# EAGLE schematic boosterpack_0v1_EAGLE_sch (EAGLE 7.2.0)
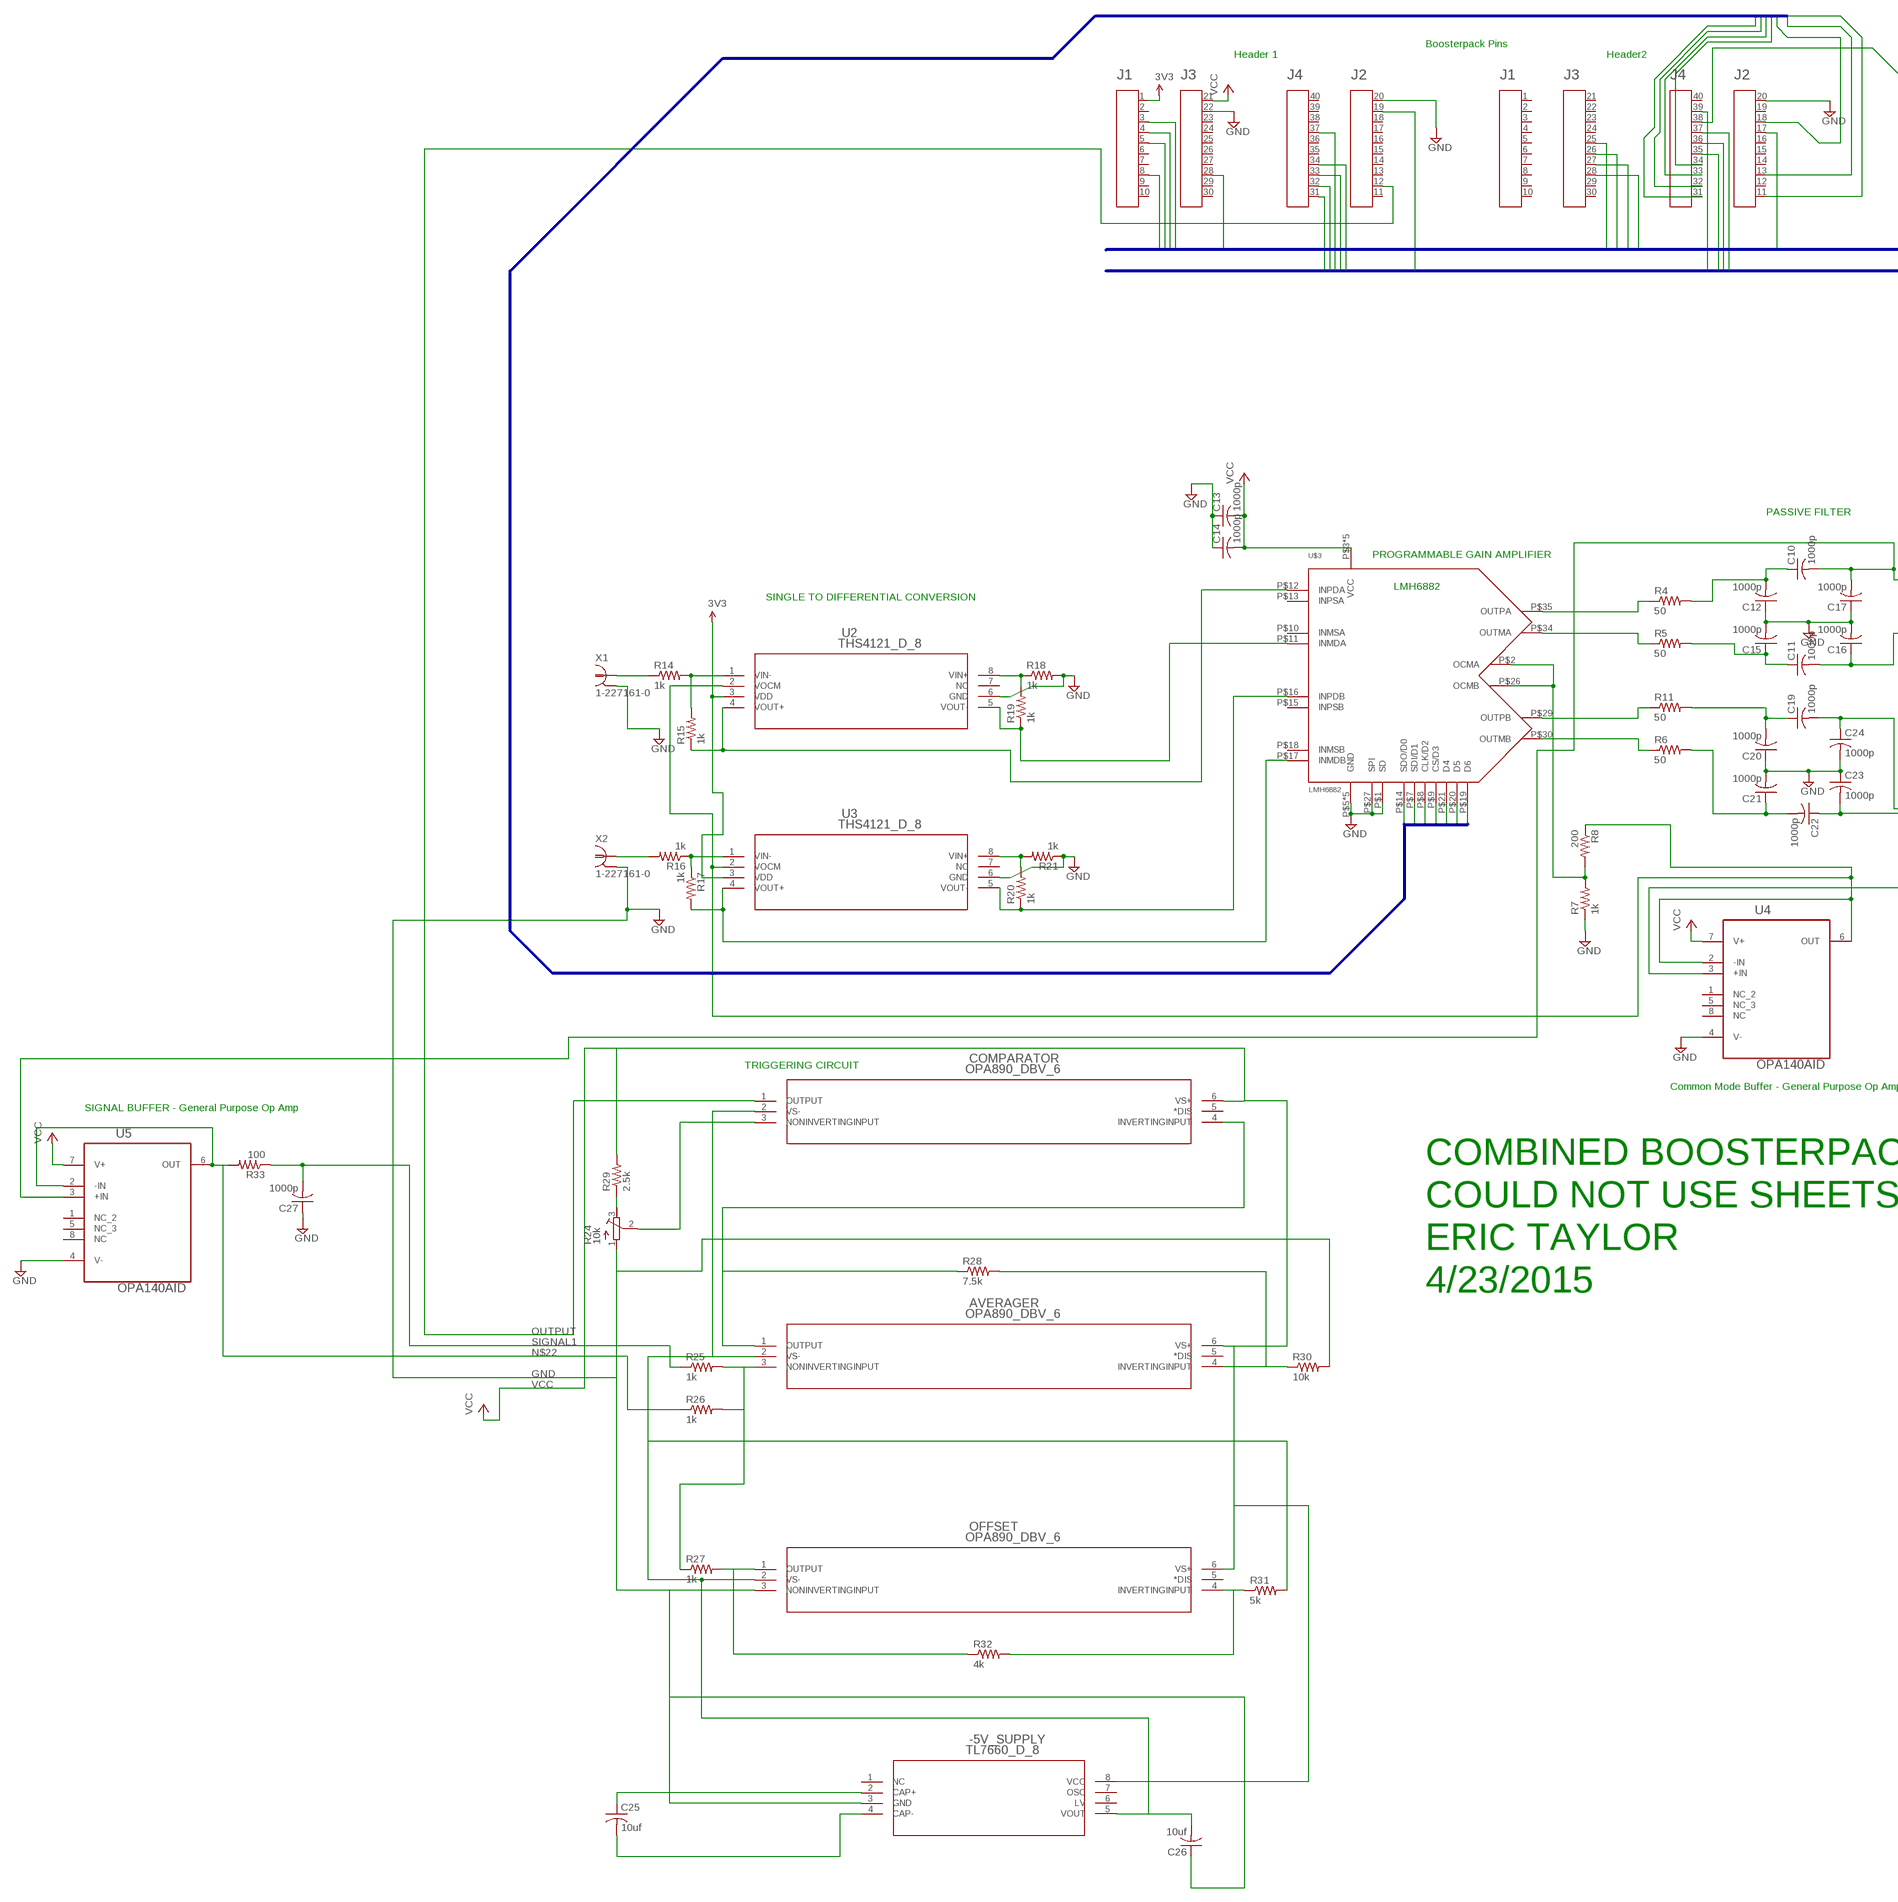
[diagram p0: schematic, sheet 1, part 1 of 2]
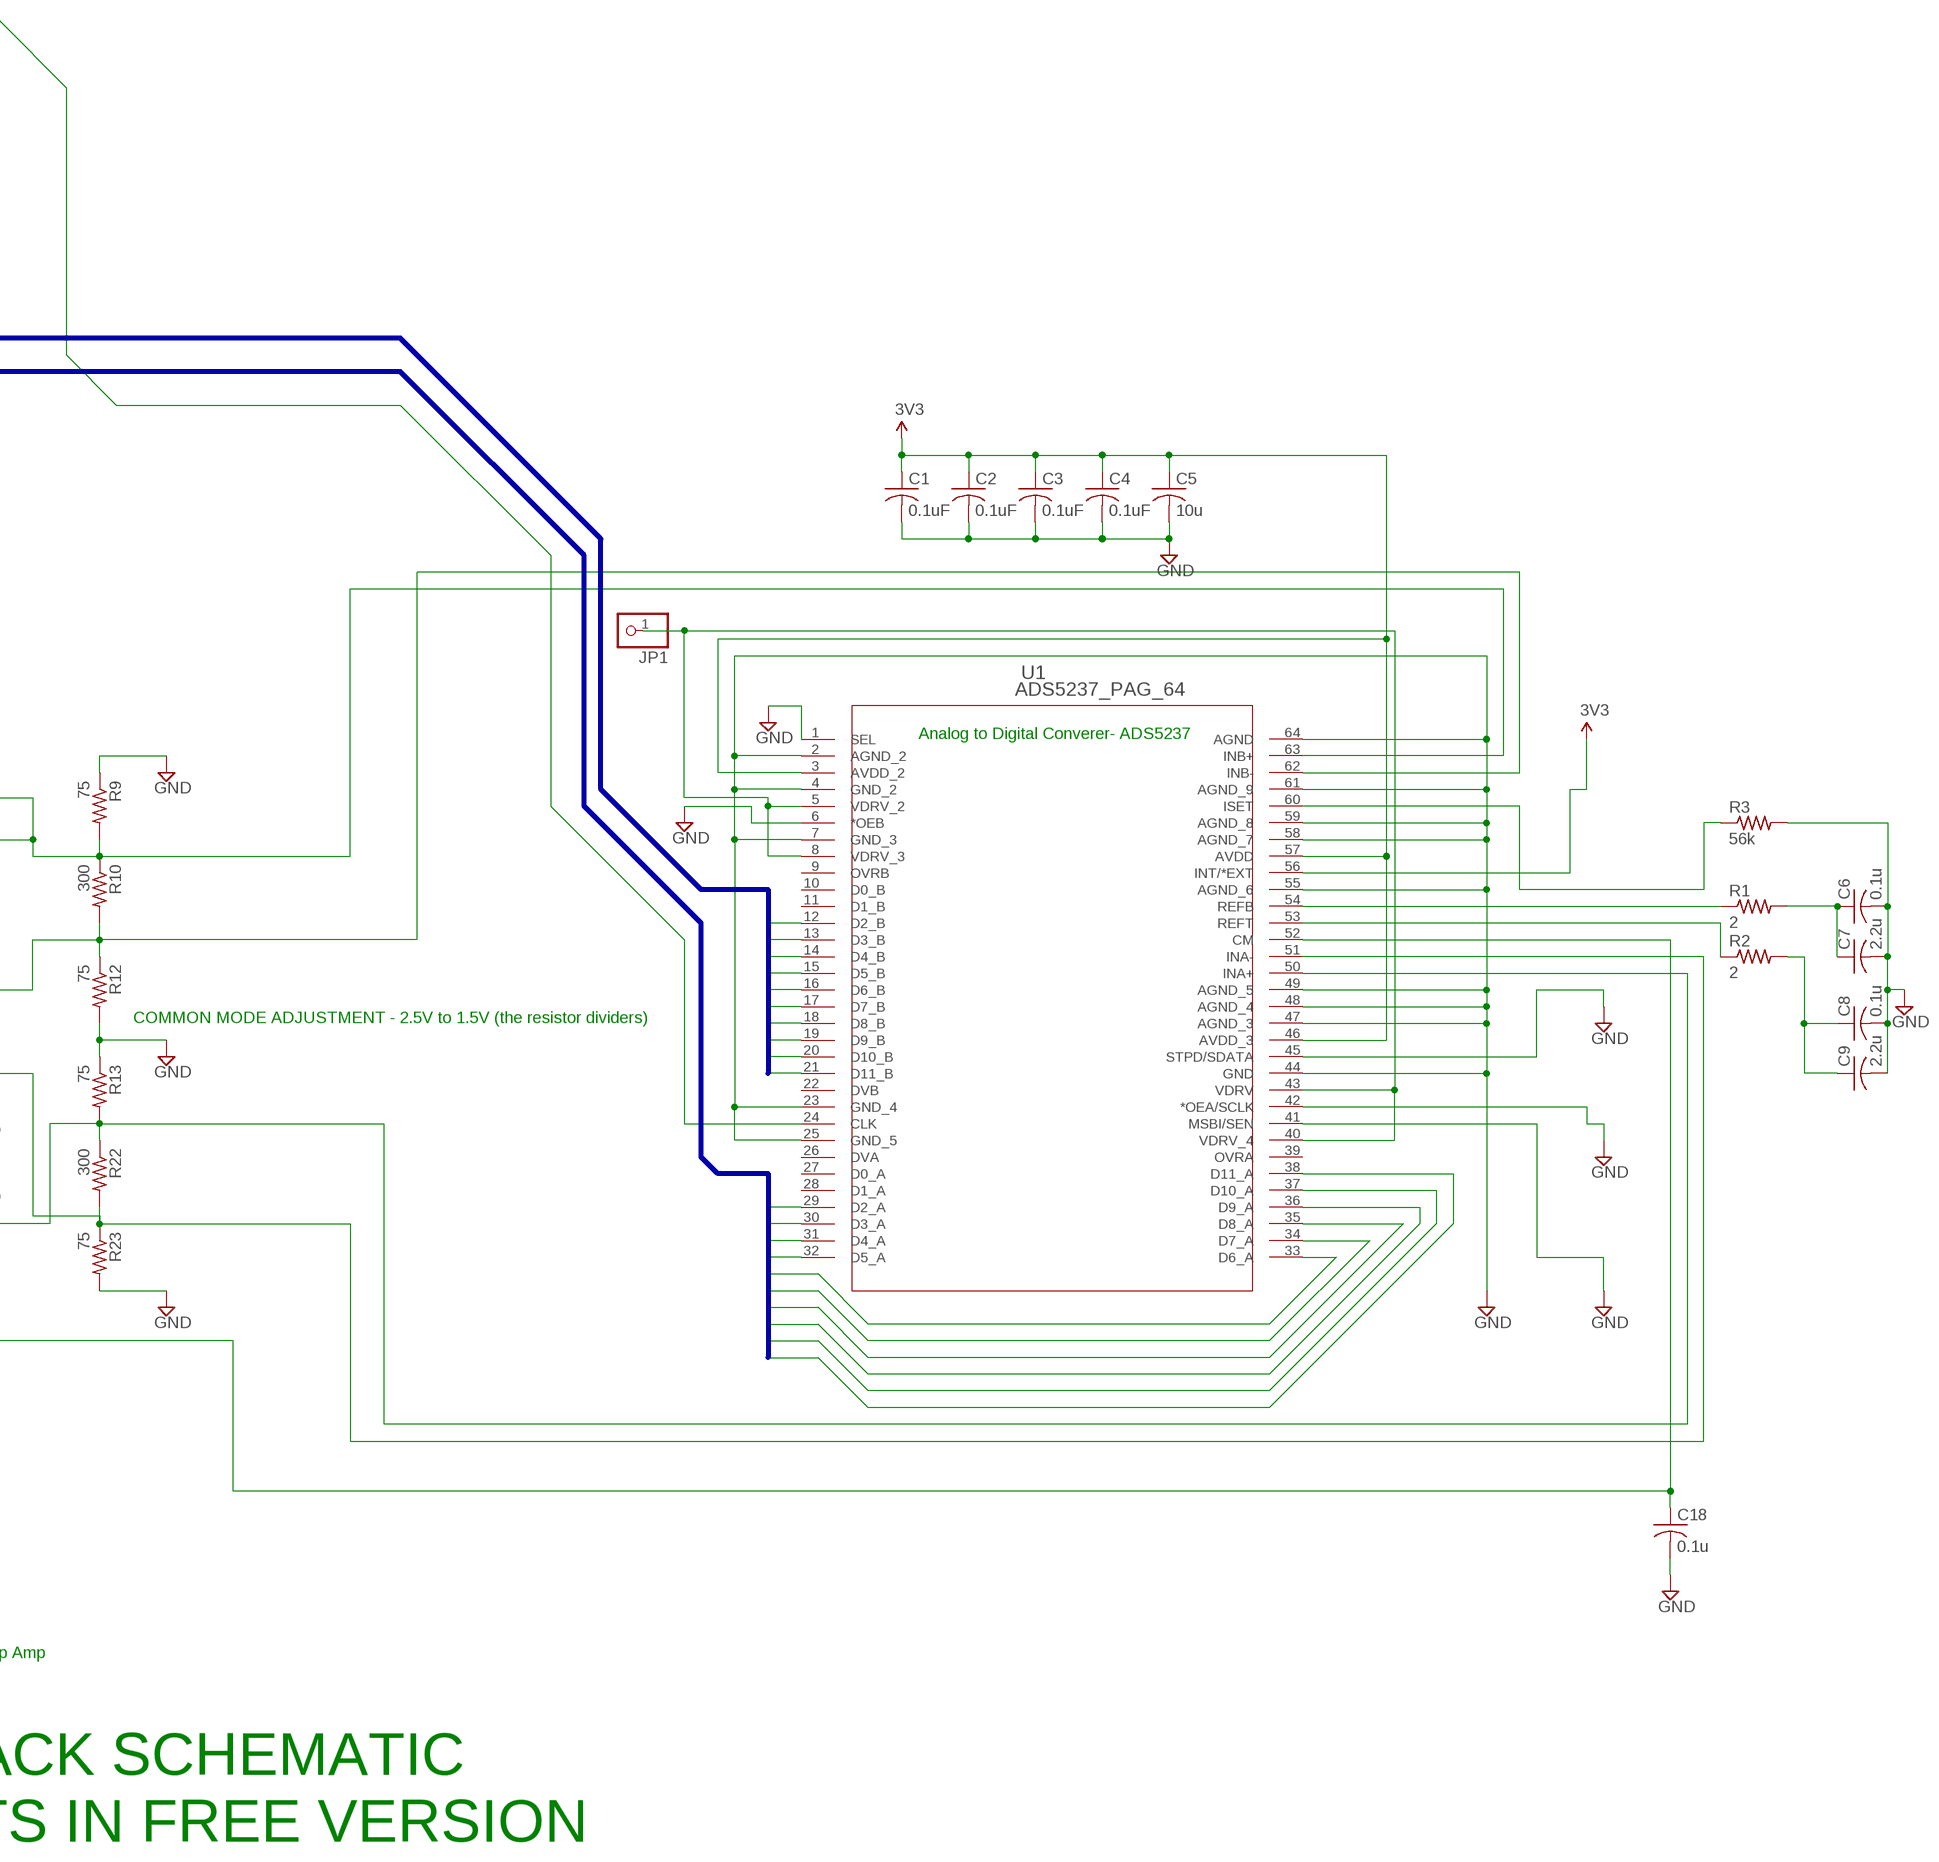
[diagram p1: schematic, sheet 1, part 2 of 2]

## Parts
-5V_SUPPLY  TL7660_D_8  [D8]
A1  HEADER4X10-BOOSTERPACK  [4X10-BOOSTERPACK]
A2  HEADER4X10-BOOSTERPACK  [4X10-BOOSTERPACK]
AVERAGER  OPA890_DBV_6  [DBV6]
C1  0.1uF  C-USC0603  [C0603]
C2  0.1uF  C-USC0603  [C0603]
C3  0.1uF  C-USC0603  [C0603]
C4  0.1uF  C-USC0603  [C0603]
C5  10u  C-USC0805  [C0805]
C6  0.1u  C-USC0805  [C0805]
C7  2.2u  C-USC0805  [C0805]
C8  0.1u  C-USC0805  [C0805]
C9  2.2u  C-USC0805  [C0805]
C10  1000p  C-USC0805  [C0805]
C11  1000p  C-USC0805  [C0805]
C12  1000p  C-USC0805  [C0805]
C13  1000p  C-USC0805  [C0805]
C14  1000p  C-USC0805  [C0805]
C15  1000p  C-USC0805  [C0805]
C16  1000p  C-USC0805  [C0805]
C17  1000p  C-USC0805  [C0805]
C18  0.1u  C-USC0805  [C0805]
C19  1000p  C-USC0805  [C0805]
C20  1000p  C-USC0805  [C0805]
C21  1000p  C-USC0805  [C0805]
C22  1000p  C-USC0805  [C0805]
C23  1000p  C-USC0805  [C0805]
C24  1000p  C-USC0805  [C0805]
C25  10uf  C-USC0805  [C0805]
C26  10uf  C-USC0805  [C0805]
C27  1000p  C-USC0805  [C0805]
COMPARATOR  OPA890_DBV_6  [DBV6]
JP1  PINHD-1X1  [1X01]
OFFSET  OPA890_DBV_6  [DBV6]
R1  2  R-US_R0805  [R0805]
R2  2  R-US_R0805  [R0805]
R3  56k  R-US_R0805  [R0805]
R4  50  R-US_R0805  [R0805]
R5  50  R-US_R0805  [R0805]
R6  50  R-US_R0805  [R0805]
R7  1k  R-US_R0805  [R0805]
R8  200  R-US_R0805  [R0805]
R9  75  R-US_R0805  [R0805]
R10  300  R-US_R0805  [R0805]
R11  50  R-US_R0805  [R0805]
R12  75  R-US_R0805  [R0805]
R13  75  R-US_R0805  [R0805]
R14  1k  R-US_R0805  [R0805]
R15  1k  R-US_R0805  [R0805]
R16  1k  R-US_R0805  [R0805]
R17  1k  R-US_R0805  [R0805]
R18  1k  R-US_R0805  [R0805]
R19  1k  R-US_R0805  [R0805]
R20  1k  R-US_R0805  [R0805]
R21  1k  R-US_R0805  [R0805]
R22  300  R-US_R0805  [R0805]
R23  75  R-US_R0805  [R0805]
R24  10k  R-TRIMM64W  [RTRIM64W]
R25  1k  R-US_M0805  [M0805]
R26  1k  R-US_M0805  [M0805]
R27  1k  R-US_M0805  [M0805]
R28  7.5k  R-US_M0805  [M0805]
R29  2.5k  R-US_M0805  [M0805]
R30  10k  R-US_M0805  [M0805]
R31  5k  R-US_M0805  [M0805]
R32  4k  R-US_M0805  [M0805]
R33  100  R-US_R0805  [R0805]
U1  ADS5237_PAG_64  [PAG64]
U2  THS4121_D_8  [D8]
U3  THS4121_D_8  [D8]
U4  OPA140AID  [SOIC127P600X175-8N]
U5  OPA140AID  [SOIC127P600X175-8N]
U$3  LMH6882  [WQFN-36-NJK]
X1  1-227161-0  [AMP_227161]
X2  1-227161-0  [AMP_227161]

## Nets
3.3V: A2.1 C1.1 C2.1 C3.1 C4.1 C5.1 U1.3(AVDD_2) U1.46(AVDD_3) U1.56(INT/*EXT) U1.57(AVDD) U2.3(VDD) U3.3(VDD) ; supply symbol labelled 3V3
A0: A1.25 U1.12(D2_B)
A1: A1.26 U1.13(D3_B)
A2: A1.27 U1.14(D4_B)
A3: A1.28 U1.15(D5_B)
A4: A2.8 U1.16(D6_B)
A5: A2.5 U1.17(D7_B)
A6: A2.4 U1.18(D8_B)
A7: A2.3 U1.19(D9_B)
A8: A2.28 U1.20(D10_B)
A9: A1.17 U1.21(D11_B)
B0: A1.39 U1.29(D2_A)
B1: A2.37 U1.30(D3_A)
B2: A2.19 U1.31(D4_A)
B3: A1.35 U1.32(D5_A)
B4: A1.36 U1.33(D6_A)
B5: A1.37 U1.34(D7_A)
B6: A2.34 U1.35(D8_A)
B7: A2.33 U1.36(D9_A)
B8: A2.32 U1.37(D10_A)
B9: A2.31 U1.38(D11_A)
C0: A1.11 U$3.P$14(SDO/D0)
C1: A1.13 U$3.P$7(SDI/D1)
C2: A1.18 U$3.P$8(CLK/D2)
C3: A1.34 U$3.P$9(CS/D3)
C4: A1.33 U$3.P$21(D4)
C5: A1.32 U$3.P$20(D5)
C6: A1.31 U$3.P$19(D6)
GND: -5V_SUPPLY.3(GND) A1.20 A2.20 A2.22 C1.2 C2.2 C3.2 C4.2 C5.2 C6.2 C7.2 C8.2 C9.2 C12.1 C13.1 C14.1 C15.2 C16.2 C17.1 C18.2 C20.1 C21.2 C23.1 C24.2 C26.1 C27.1 OFFSET.3(NONINVERTINGINPUT) R3.2 R7.1 R9.1 R12.2 R13.1 R18.2 R21.1 R23.2 R24.1(E) R30.2 U1.1(SEL) U1.2(AGND_2) U1.4(GND_2) U1.6(*OEB) U1.7(GND_3) U1.23(GND_4) U1.25(GND_5) U1.41(MSBI/SEN) U1.42(*OEA/SCLK) U1.44(GND) U1.45(STPD/SDATA) U1.47(AGND_3) U1.48(AGND_4) U1.49(AGND_5) U1.55(AGND_6) U1.58(AGND_7) U1.59(AGND_8) U1.61(AGND_9) U1.64(AGND) U2.6(GND) U3.6(GND) U4.4(V-) U5.4(V-) U$3.P$1(SD) U$3.P$5(GND) U$3.P$6(GND) U$3.P$22(GND) U$3.P$23(GND) U$3.P$27(SPI) U$3.TH(GND) X1.2 X2.2
N$1: A1.38 U1.24(CLK)
N$2: JP1.1 U1.5(VDRV_2) U1.8(VDRV_3) U1.40(VDRV_4) U1.43(VDRV)
N$3: C18.1 U1.52(CM) U4.3(+IN)
N$4: C19.2 C24.1 R22.2 R23.1 U1.51(INA-)
N$5: R24.3(A) R29.1
N$6: COMPARATOR.3(NONINVERTINGINPUT) R24.2(S)
N$7: AVERAGER.4(INVERTINGINPUT) R28.2 R30.1
N$8: C11.1 C15.1 R5.2
N$9: R8.1 U2.2(VOCM) U3.2(VOCM) U4.2(-IN) U4.6(OUT)
N$10: R7.2 R8.2 U$3.P$2(OCMA) U$3.P$26(OCMB)
N$11: AVERAGER.3(NONINVERTINGINPUT) R25.2 R26.2 R27.1
N$13: C11.2 C16.1 R10.2 R12.1 U1.62(INB-)
N$14: C21.1 C22.2 R6.2
N$15: C19.1 C20.2 R11.2
N$16: AVERAGER.1(OUTPUT) COMPARATOR.4(INVERTINGINPUT) R28.1
N$17: C22.1 C23.2 R13.2 R22.1 U1.50(INA+)
N$18: OFFSET.1(OUTPUT) R27.2 R32.1
N$20: OFFSET.4(INVERTINGINPUT) R31.1 R32.2
N$21: R5.1 U$3.P$34(OUTMA)
N$22: R26.1 R33.2 U5.2(-IN) U5.6(OUT)
N$23: -5V_SUPPLY.2(CAP+) C25.1
N$24: -5V_SUPPLY.4(CAP-) C25.2
N$25: -5V_SUPPLY.5(VOUT) AVERAGER.2(VS-) C26.2 COMPARATOR.2(VS-) OFFSET.2(VS-) R31.2
N$26: C10.2 C17.2 R9.2 R10.1 U1.63(INB+) U5.3(+IN)
N$27: R4.1 U$3.P$35(OUTPA)
N$29: C6.1 C7.1 R1.2
N$30: C8.1 C9.1 R2.2
N$31: R1.1 U1.54(REFB)
N$32: R2.1 U1.53(REFT)
N$33: R3.1 U1.60(ISET)
N$34: R14.1 X1.1
N$41: R6.1 U$3.P$30(OUTMB)
N$42: R14.2 R15.2 U2.1(VIN-)
N$43: R15.1 U2.4(VOUT+) U$3.P$12(INPDA)
N$44: R16.1 R17.1 U3.1(VIN-)
N$47: R17.2 U3.4(VOUT+) U$3.P$17(INMDB)
N$48: R18.1 R19.2 U2.8(VIN+)
N$49: R20.2 R21.2 U3.8(VIN+)
N$51: R16.2 X2.1
N$59: R20.1 U3.5(VOUT-) U$3.P$16(INPDB)
N$60: R19.1 U2.5(VOUT-) U$3.P$11(INMDA)
N$62: R11.1 U$3.P$29(OUTPB)
N$67: C10.1 C12.2 R4.2
OUTPUT: A2.12 COMPARATOR.1(OUTPUT)
SIGNAL1: C27.2 R25.1 R33.1
VCC: -5V_SUPPLY.8(VCC) A2.21 AVERAGER.6(VS+) C13.2 C14.2 COMPARATOR.6(VS+) OFFSET.6(VS+) R29.2 U4.7(V+) U5.7(V+) U$3.P$3(VCC) U$3.P$4(VCC) U$3.P$24(VCC) U$3.P$25(VCC) U$3.P$36(VCC)
Unconnected: -5V_SUPPLY.1(NC) -5V_SUPPLY.6(LV) -5V_SUPPLY.7(OSC) A1.1 A1.2 A1.3 A1.4 A1.5 A1.6 A1.7 A1.8 A1.9 A1.10 A1.12 A1.14 A1.15 A1.16 A1.19 A1.21 A1.22 A1.23 A1.24 A1.29 A1.30 A1.40 A2.2 A2.6 A2.7 A2.9 A2.10 A2.11 A2.13 A2.14 A2.15 A2.16 A2.17 A2.18 A2.23 A2.24 A2.25 A2.26 A2.27 A2.29 A2.30 A2.35 A2.36 A2.38 A2.39 A2.40 AVERAGER.5(*DIS) COMPARATOR.5(*DIS) OFFSET.5(*DIS) U1.9(OVRB) U1.10(D0_B) U1.11(D1_B) U1.22(DVB) U1.26(DVA) U1.27(D0_A) U1.28(D1_A) U1.39(OVRA) U2.7(NC) U3.7(NC) U4.1(NC_2) U4.5(NC_3) U4.8(NC) U5.1(NC_2) U5.5(NC_3) U5.8(NC) U$3.P$10(INMSA) U$3.P$13(INPSA) U$3.P$15(INPSB) U$3.P$18(INMSB)

## Buses
A[0..9]
B[0..9]
C[0..6]

## Notes on the sheet
- Boosterpack Pins
- Header 1 | Header2
- Analog to Digital Converer- ADS5237
- PASSIVE FILTER
- PROGRAMMABLE GAIN AMPLIFIER
- LMH6882
- SINGLE TO DIFFERENTIAL CONVERSION
- COMMON MODE ADJUSTMENT - 2.5V to 1.5V (the resistor dividers)
- TRIGGERING CIRCUIT
- Common Mode Buffer - General Purpose Op Amp
- SIGNAL BUFFER - General Purpose Op Amp
- COMBINED BOOSTERPACK SCHEMATIC
- COULD NOT USE SHEETS IN FREE VERSION
- ERIC TAYLOR
- 4/23/2015

## Library data of the parts
-5V_SUPPLY = TL7660:TL7660_D_8; DATASHEETURL: http://www.ti.com/lit/gpn/TL7660; DESCRIPTION: CMOS Voltage Converter; FAMILY_NAME: LOW POWER; GENERIC_PART_NUMBER: TL7660; INDUSTRY_STD_PKG_TYPE: SOIC; MANUFACTURER: Texas Instruments; MANUFACTURER_PART_NUMBER: tl7660_d_8; PACKAGE_DESIGNATOR: D; PIN_COUNT: 8; VENDOR: Texas Instruments
A1 A2 = EAGLE_BoosterPack_Library:HEADER4X10-BOOSTERPACK
AVERAGER COMPARATOR OFFSET = OPA890:OPA890_DBV_6; DATASHEETURL: http://www.ti.com/lit/gpn/OPA890; DESCRIPTION: Low Power, Wideband, Voltage Feedback Operational Amplifier with Disable; FAMILY_NAME: VOLTAGE FEEDBACK; GENERIC_PART_NUMBER: OPA890; INDUSTRY_STD_PKG_TYPE: SOT-23; MANUFACTURER: Texas Instruments; MANUFACTURER_PART_NUMBER: opa890_dbv_6; PACKAGE_DESIGNATOR: DBV; PIN_COUNT: 6; VENDOR: Texas Instruments
C1-C4 = adafruit:C-US: CAPACITOR, American symbol
C5 = resistor:C-US: CAPACITOR, American symbol; C: 10uF
C6-C17 C19-C27 = resistor:C-US: CAPACITOR, American symbol
C18 = resistor:C-US: CAPACITOR, American symbol; C: 0.1uF
JP1 = adafruit:PINHD-1X1: Pin header 1x1 for 0.1" spacing With round pins
R1-R23 R25-R33 = resistor:R-US_: RESISTOR, American symbol
R24 = resistor:R-TRIMM: Trimm resistor
U1 = ADC:ADS5237_PAG_64; DATASHEETURL: http://www.ti.com/lit/gpn/ADS5237; DESCRIPTION: Dual, 10-Bit, 65MSPS, +3.3V Analog-to-Digital Converter; FAMILY_NAME: HIGH SPEED ADC (>10MSPS); GENERIC_PART_NUMBER: ADS5237; INDUSTRY_STD_PKG_TYPE: TQFP; MANUFACTURER: Texas Instruments; PACKAGE_DESIGNATOR: PAG; PIN_COUNT: 64
U2 U3 = ADC:THS4121_D_8; DATASHEETURL: http://www.ti.com/lit/gpn/THS4121; DESCRIPTION: 3.3 V, 100 MHz, 43 V/us, Fully Differential CMOS Amplifier; FAMILY_NAME: FULLY DIFFERENTIAL AMPLIFIER; GENERIC_PART_NUMBER: THS4121; INDUSTRY_STD_PKG_TYPE: SOIC; MANUFACTURER: Texas Instruments; MANUFACTURER_PART_NUMBER: ths4121_d_8; PACKAGE_DESIGNATOR: D; PIN_COUNT: 8; VENDOR: Texas Instruments
U4 U5 = Texas Instruments_By_element14_Batch_1:OPA140AID: 11MHz JFET Op Amp; MPN: OPA140AID; OC_FARNELL: 1855117; OC_NEWARK: 13T8920; PACKAGE: SOIC-8; SUPPLIER: Texas Instruments
U$3 = lmh6882:LMH6882
X1 X2 = con-coax:?227161*: JACK, RIGHT ANGLE, 50 OHM, PCB, BNC Source: amp_227161.pdf; MF: TYCO ELECTRONICS; MPN: 1-227161; OC_FARNELL: unknown; OC_NEWARK: 33B3200